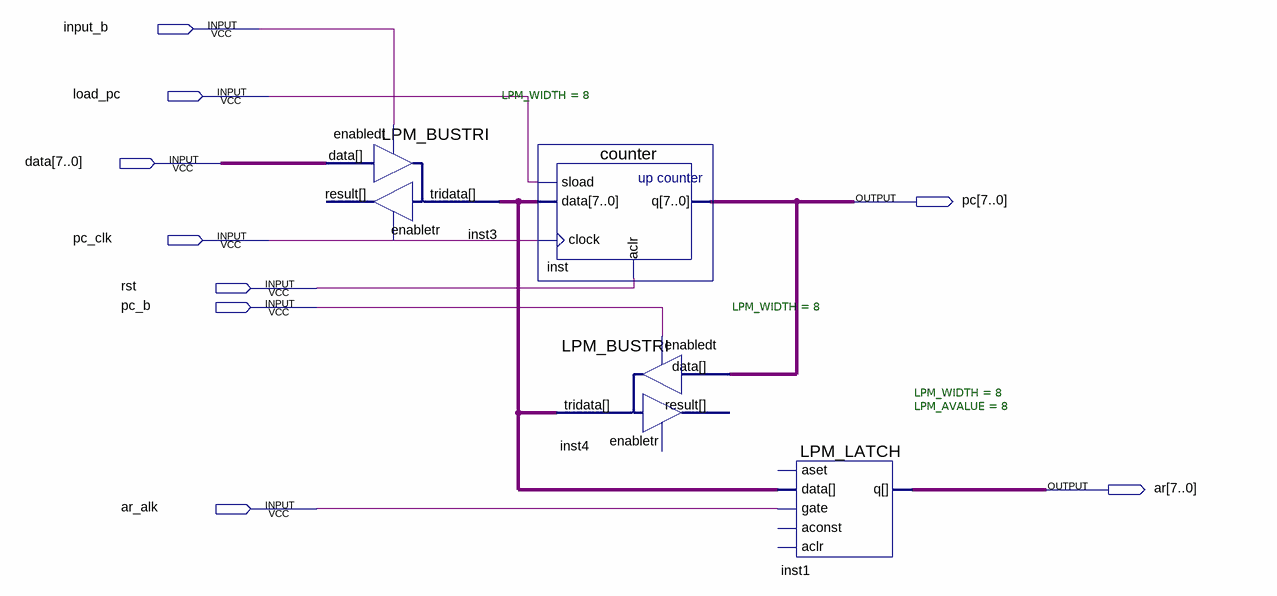
[diagram p0: schematic sheet]
// Quartus schematic task5.bdf as structural Verilog: 4 symbols, 9 pins
module task5 (
  input  input_b,
  input  load_pc,
  input  [7:0] data,
  input  pc_clk,
  input  rst,
  input  pc_b,
  input  ar_alk,
  output [7:0] pc,
  output [7:0] ar
);

  wire [7:0] inst3_tridata;

  LPM_BUSTRI #(.LPM_WIDTH(8)) inst3 (
    .data(data), .enabledt(input_b), .enabletr(pc_clk), .tridata(inst3_tridata));  // open: result
  counter inst (.sload(load_pc), .data(inst3_tridata), .clock(pc_clk), .aclr(rst), .q(pc));
  LPM_BUSTRI #(.LPM_WIDTH(8)) inst4 (.data(pc), .enabledt(pc_b), .tridata(inst3_tridata));  // open: enabletr, result
  LPM_LATCH #(.LPM_WIDTH(8), .LPM_AVALUE(8)) inst1 (
    .data(inst3_tridata), .gate(ar_alk), .q(ar));  // open: aset, aconst, aclr
endmodule
